# Altium schematic sheet CoreBoard2.SchDoc: MCU 2
size A4; DrawnBy: Poon Mannchun; Revision: V 3.3
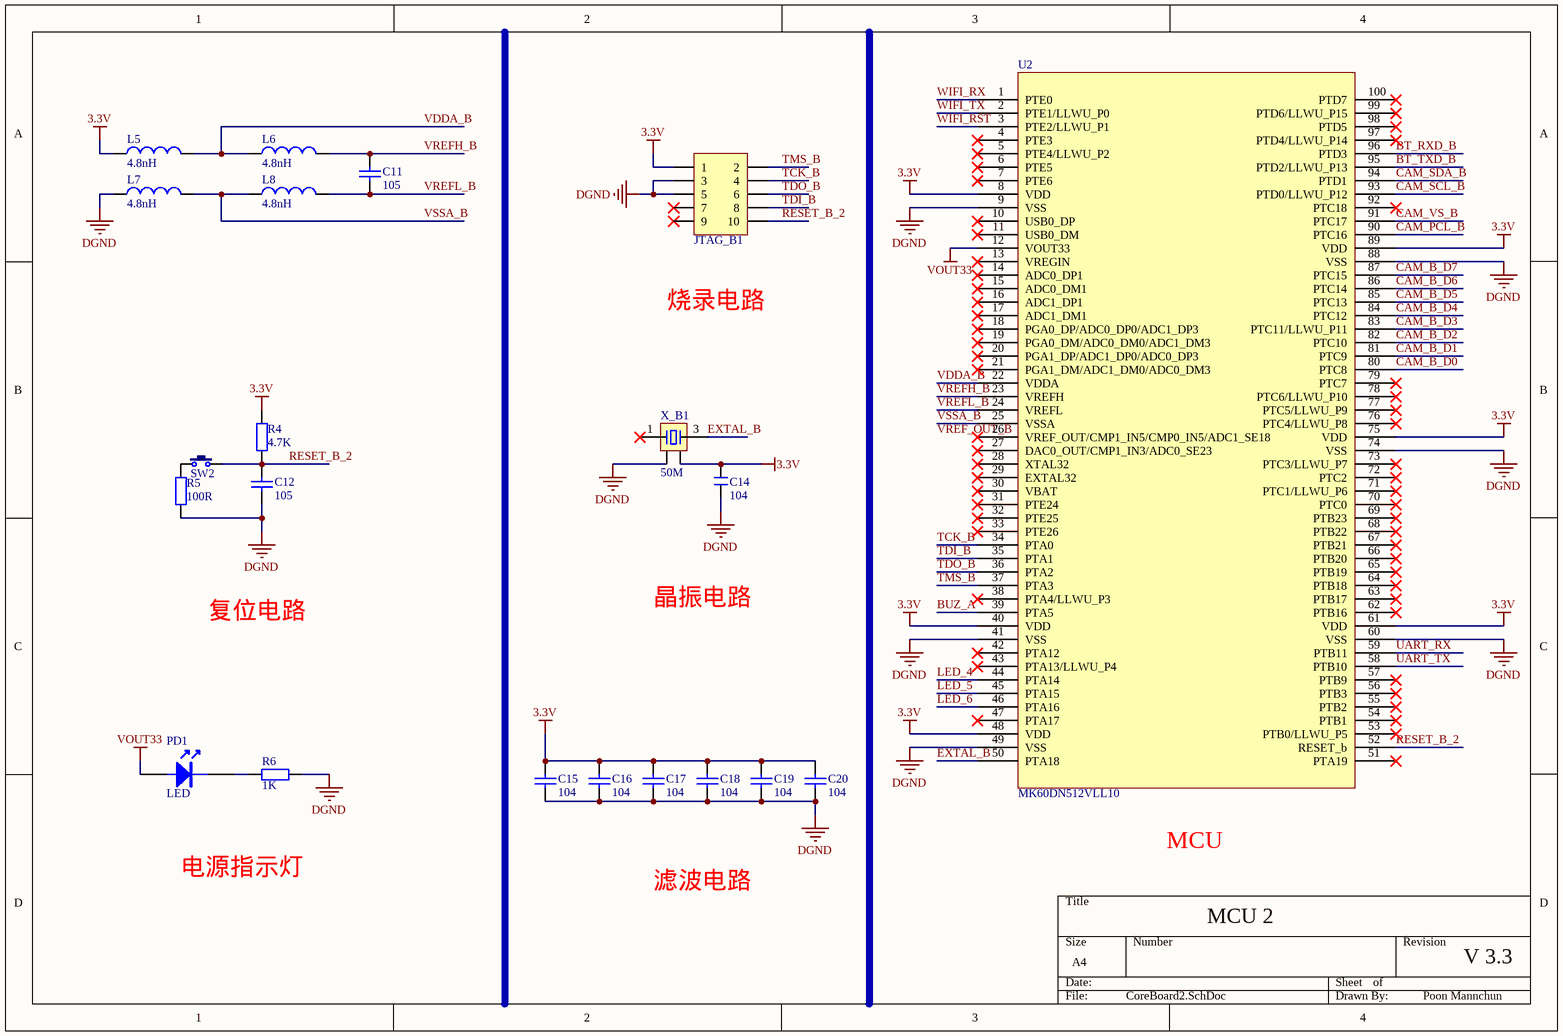
[diagram p0: CoreBoard2.SchDoc]

## Parts
C11  105  [C 0805_L]
C12  105  [C 0805_L]
C14  104  [C 0805]
C15  104  [C 0805_L]
C16  104  [C 0805_L]
C17  104  [C 0805_L]
C18  104  [C 0805_L]
C19  104  [C 0805_L]
C20  104  [C 0805_L]
JTAG_B1  Header 5X2  [HDR-5X2]  (value not drawn)
L5  4.8nH  [L 0805]
L6  4.8nH  [L 0805]
L7  4.8nH  [L 0805]
L8  4.8nH  [L 0805]
PD1  LED  [LED 0805R]
R4  4.7K  [R 0805_L]
R5  100R  [R 0805_L]
R6  1K  [R 0805_L]
SW2  3x6x5  [TSW SMD-3*6*2.5]  (value not drawn)
U2  MK60DN512VLL10  [LQFP100 14x14_N]
X_B1  50M  [OSC 5032-4P]

## Nets
3.3V: C14.2 C15.2 C16.2 C17.2 C18.2 C19.2 C20.2 JTAG_B1.1 L5.1 R4.2 U2.8(VDD) U2.40(VDD) U2.48(VDD) U2.61(VDD) U2.75(VDD) U2.89(VDD) X_B1.4
DGND: C12.1 C14.1 C15.1 C16.1 C17.1 C18.1 C19.1 C20.1 JTAG_B1.3 JTAG_B1.5 L7.1 R5.1 R6.2 U2.9(VSS) U2.41(VSS) U2.49(VSS) U2.60(VSS) U2.74(VSS) U2.88(VSS) X_B1.2
VOUT33: PD1.A U2.12(VOUT33)
BT_RXD_B: U2.96(PTD3)
BT_TXD_B: U2.95(PTD2/LLWU_P13)
BUZ_A: U2.39(PTA5)
CAM_B_D0: U2.80(PTC8)
CAM_B_D1: U2.81(PTC9)
CAM_B_D2: U2.82(PTC10)
CAM_B_D3: U2.83(PTC11/LLWU_P11)
CAM_B_D4: U2.84(PTC12)
CAM_B_D5: U2.85(PTC13)
CAM_B_D6: U2.86(PTC14)
CAM_B_D7: U2.87(PTC15)
CAM_PCL_B: U2.90(PTC16)
CAM_SCL_B: U2.93(PTD0/LLWU_P12)
CAM_SDA_B: U2.94(PTD1)
CAM_VS_B: U2.91(PTC17)
EXTAL_B: U2.50(PTA18) X_B1.3
LED_4: U2.44(PTA14)
LED_5: U2.45(PTA15)
LED_6: U2.46(PTA16)
RESET_B_2: C12.2 JTAG_B1.10 R4.1 SW2.2 U2.52(RESET_b)
TCK_B: JTAG_B1.4 U2.34(PTA0)
TDI_B: JTAG_B1.8 U2.35(PTA1)
TDO_B: JTAG_B1.6 U2.36(PTA2)
TMS_B: JTAG_B1.2 U2.37(PTA3)
UART_RX: U2.59(PTB11)
UART_TX: U2.58(PTB10)
VDDA_B: L5.2 L6.1 U2.22(VDDA)
VREFH_B: C11.2 L6.2 U2.23(VREFH)
VREFL_B: C11.1 L8.2 U2.24(VREFL)
VSSA_B: L7.2 L8.1 U2.25(VSSA)
WIFI_RST: U2.3(PTE2/LLWU_P1)
WIFI_RX: U2.1(PTE0)
WIFI_TX: U2.2(PTE1/LLWU_P0)
NetPD1_K: PD1.K R6.1
NetR5_2: R5.2 SW2.1

Not connected (* = marked no-connect by the designer): JTAG_B1 7* 9*; U2 4(PTE3)* 5(PTE4/LLWU_P2)* 6(PTE5)* 7(PTE6)* 10(USB0_DP)* 11(USB0_DM)* 13(VREGIN)* 14(ADC0_DP1)* 15(ADC0_DM1)* 16(ADC1_DP1)* 17(ADC1_DM1)* 18(PGA0_DP/ADC0_DP0/ADC1_DP3)* 19(PGA0_DM/ADC0_DM0/ADC1_DM3)* 20(PGA1_DP/ADC1_DP0/ADC0_DP3)* 21(PGA1_DM/ADC1_DM0/ADC0_DM3)* 26(VREF_OUT/CMP1_IN5/CMP0_IN5/ADC1_SE18)* 27(DAC0_OUT/CMP1_IN3/ADC0_SE23)* 28(XTAL32)* 29(EXTAL32)* 30(VBAT)* 31(PTE24)* 32(PTE25)* 33(PTE26)* 38(PTA4/LLWU_P3)* 42(PTA12)* 43(PTA13/LLWU_P4)* 47(PTA17)* 51(PTA19)* 53(PTB0/LLWU_P5)* 54(PTB1)* 55(PTB2)* 56(PTB3)* 57(PTB9)* 62(PTB16)* 63(PTB17)* 64(PTB18)* 65(PTB19)* 66(PTB20)* 67(PTB21)* 68(PTB22)* 69(PTB23)* 70(PTC0)* 71(PTC1/LLWU_P6)* 72(PTC2)* 73(PTC3/LLWU_P7)* 76(PTC4/LLWU_P8)* 77(PTC5/LLWU_P9)* 78(PTC6/LLWU_P10)* 79(PTC7)* 92(PTC18)* 97(PTD4/LLWU_P14)* 98(PTD5)* 99(PTD6/LLWU_P15)* 100(PTD7)*; X_B1 1*

## Notes on the sheet
- 烧录电路
- 复位电路
- 晶振电路
- MCU
- 电源指示灯
- 滤波电路
- Labels drawn without touching a wire or pin: VREF_OUT_B

## Library data of the parts
C11 C12 C15-C20 = CAP: Capacitor; Published: 8-Jun-2000; Revision: July-2002: Re-released for DXP Platform.; Publisher: Altium Limited
C14 = C: 无极性贴片电容; 版权归属: 源创客; BOM名称: 无极性贴片电容; 学习资源: www.ooocke.com
JTAG_B1 = Header 5X2: 5*2P接插件; 版权归属: 源创客; BOM名称: 5*2P接插件; 学习资源: www.ooocke.com
L5-L8 = Inductor: Code_IEC: 1005; Published: 8-Jun-2000; LatestRevisionDate: 17-Jul-2002; LatestRevisionNote: Re-released for DXP Platform.; PackageReference: 0402-A; Publisher: Altium Limited; Code_JEITA: 0402
PD1 = LED: pin to pad: A>1 K>2
R4-R6 = Res2: Resistor; Published: 8-Jun-2000; LatestRevisionDate: 17-Jul-2002; LatestRevisionNote: Re-released for DXP Platform.; PackageReference: AXIAL-0.4; Publisher: Altium Limited
SW2 = TSW 3x6: 3x6轻触开关; 版权归属: 源创客; BOM名称: 3x6轻触开关; 学习资源: www.ooocke.com
U2 = MK60DN512ZVLQ10: MK60DN512ZVLL10
X_B1 = XTAL-4: 4脚晶振; 版权归属: 源创客; BOM名称: 4脚晶振; 学习资源: www.ooocke.com